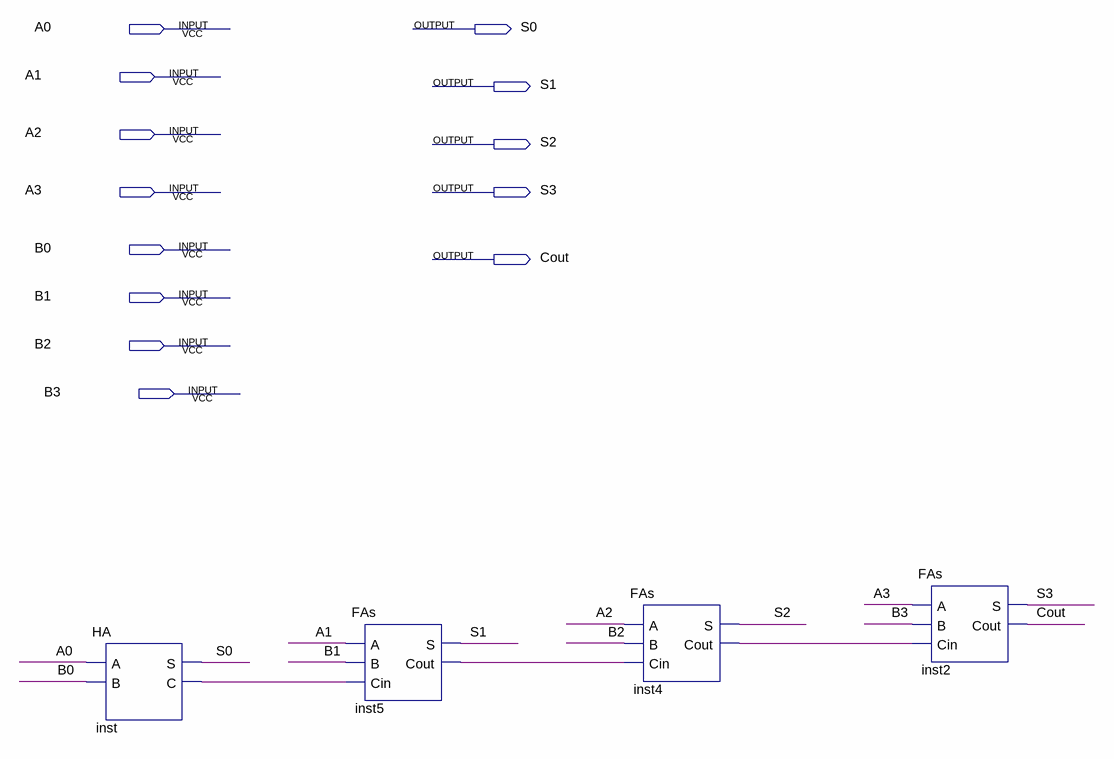
[diagram p0: schematic sheet]
// Quartus schematic RCAf.bdf as structural Verilog: 4 symbols, 13 pins
module RCAf (
  input  A0,
  input  A1,
  input  A2,
  input  A3,
  input  B0,
  input  B1,
  input  B2,
  input  B3,
  output S0,
  output S1,
  output S2,
  output S3,
  output Cout
);

  wire inst4_cout, inst5_cout, inst_c;

  HA inst (.A(A0), .B(B0), .S(S0), .C(inst_c));
  FAs inst5 (.A(A1), .B(B1), .Cin(inst_c), .S(S1), .Cout(inst5_cout));
  FAs inst4 (.A(A2), .B(B2), .Cin(inst5_cout), .S(S2), .Cout(inst4_cout));
  FAs inst2 (.A(A3), .B(B3), .Cin(inst4_cout), .S(S3), .Cout(Cout));
endmodule
